# EAGLE design rc_remote_switch (EAGLE 6.4)
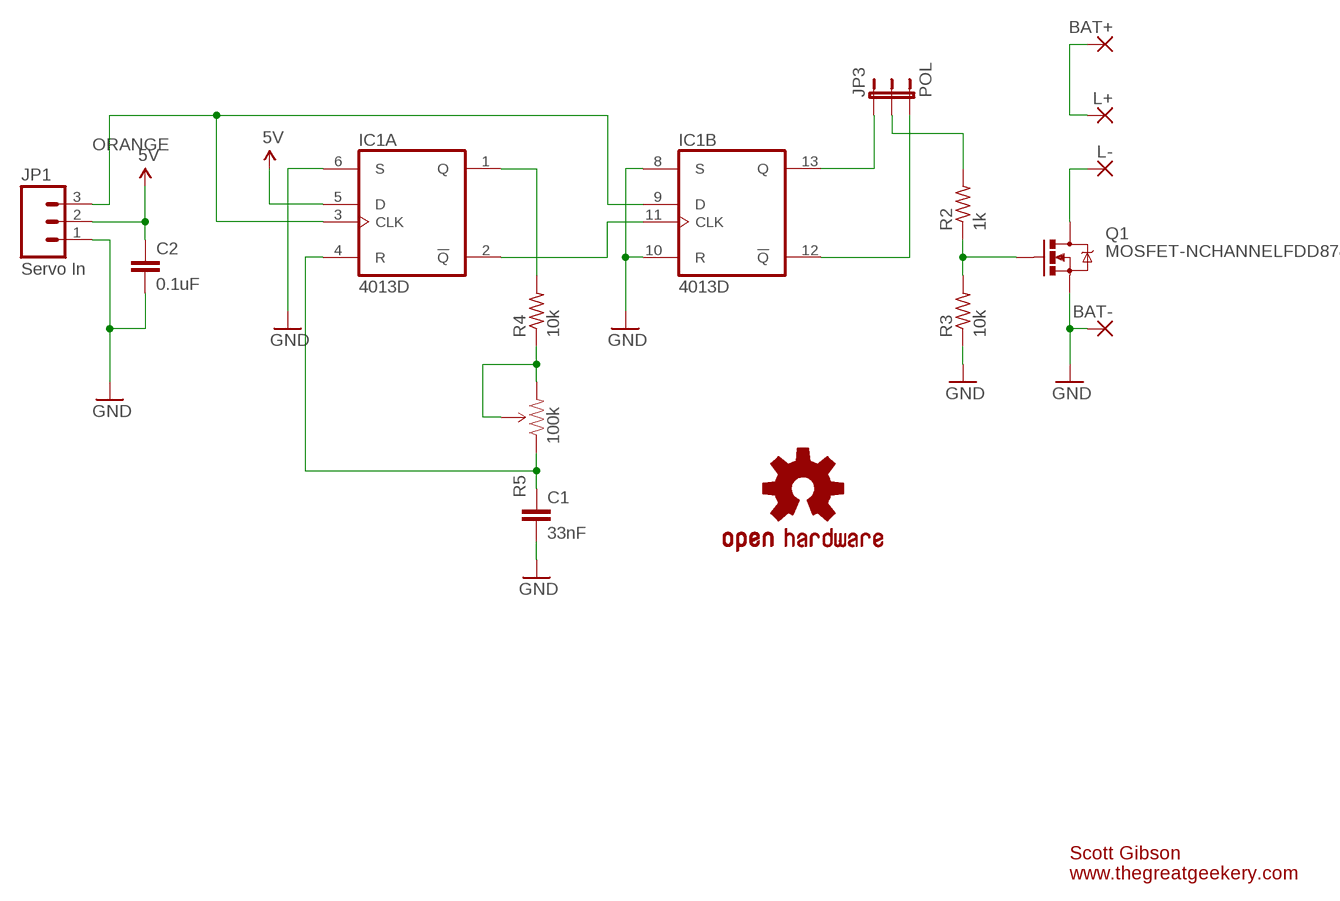
[diagram p0: schematic, sheet 1]

## Parts
BAT+  BAT+  WIREPAD4,16O1,6  [4,16O1,6]
BAT-  BAT-  WIREPAD4,16O1,6  [4,16O1,6]
C1  33nF  C-EUC0805  [C0805]
C2  0.1uF  C-EUC0805  [C0805]
IC1  4013D  [SO14]
JP1  Servo In  M03PTH  [1X03]
JP3  POL  JUMPER-3PTH  [1X03]
L+  L+  WIREPAD4,16O1,6  [4,16O1,6]
L-  L-  WIREPAD4,16O1,6  [4,16O1,6]
LOGO1  OSHW-LOGOS  [OSHW-LOGO-S]
Q1  MOSFET-NCHANNELFDD8780  [DPAK]
R2  1k  R-US_R0805  [R0805]
R3  10k  R-US_R0805  [R0805]
R4  10k  R-US_R0805  [R0805]
R5  100k  TRIMPOT3362U-2  [3362U-2]

## Nets
N$1: IC1.1(A:Q) R4.2
N$2: IC1.2(A:!Q) IC1.11(B:CLK)
N$3: IC1.13(B:Q) JP3.1
N$4: IC1.12(B:!Q) JP3.3
N$5: C1.1 IC1.4(A:R) R5.1(CCW)
N$6: R4.1 R5.2(WIPER) R5.3(CW)
N$7: Q1.1(G) R2.1 R3.2
N$8: JP3.2 R2.2
N$10: L-.1(P) Q1.4(D)
N$11: BAT+.1(P) L+.1(P)
ORANGE: IC1.3(A:CLK) IC1.9(B:D) JP1.3
VDD: BAT-.1(P) C1.2 C2.2 IC1.6(A:S) IC1.8(B:S) IC1.10(B:R) JP1.1 Q1.3(S) R3.1 ; supply symbol labelled GND
VSS: C2.1 IC1.5(A:D) JP1.2 ; supply symbol labelled 5V

## Notes on the sheet
- Scott Gibson
  www.thegreatgeekery.com

## Power pins joined to a net without a drawn wire
VDD: IC1.14(P:VDD)
VSS: IC1.7(P:VSS)

## Library data of the parts
BAT+ BAT- L+ L- = wirepad:WIREPAD: Wire PAD connect wire on PCB
C1 C2 = rcl:C-EU: CAPACITOR, European symbol
IC1 = 40xx:4013: Dual D FLIP FLOP, set/reset
JP1 = SparkFun-Connectors:M03: Header 3 Standard 3-pin 0.1" header. Use with straight break away headers (SKU : PRT-00116), right angle break away headers (PRT-00553), swiss pins (PRT-00743), machine pins (PRT-00117), and female headers (PRT-00115). Molex polarized connector foot print use with SKU : PRT-08232 with associated crimp pins and housings.
JP3 = SparkFun-Passives:JUMPER-3
LOGO1 = SparkFun-Aesthetics:OSHW-LOGO: Open Source Hardware Logo This logo indicates the piece of hardware it is found on incorporates a OSHW license and/or adheres to the definition of open source hardware found here: http://freedomdefined.org/OSHW
Q1 = SparkFun-DiscreteSemi:MOSFET-NCHANNEL: Common NMOSFET Parts MFG P/N Store ID Prod ID FDD8780 TRANS-09984 SI7820DN TRANS-11055 FDS6630A IC-08089 2N7002PW TRANS-11151 FQP30N06L COM-10213 TRANS-10060 BSS123LT1G TRANS-08345 BSS138 TRANS-00830 BS170 2N7000; PROD_ID: TRANS-09984
R2-R4 = rcl:R-US_: RESISTOR, American symbol
R5 = SparkFun-Electromechanical:TRIMPOT: Various small potentiometers for "set-and-forget" applications

## Board
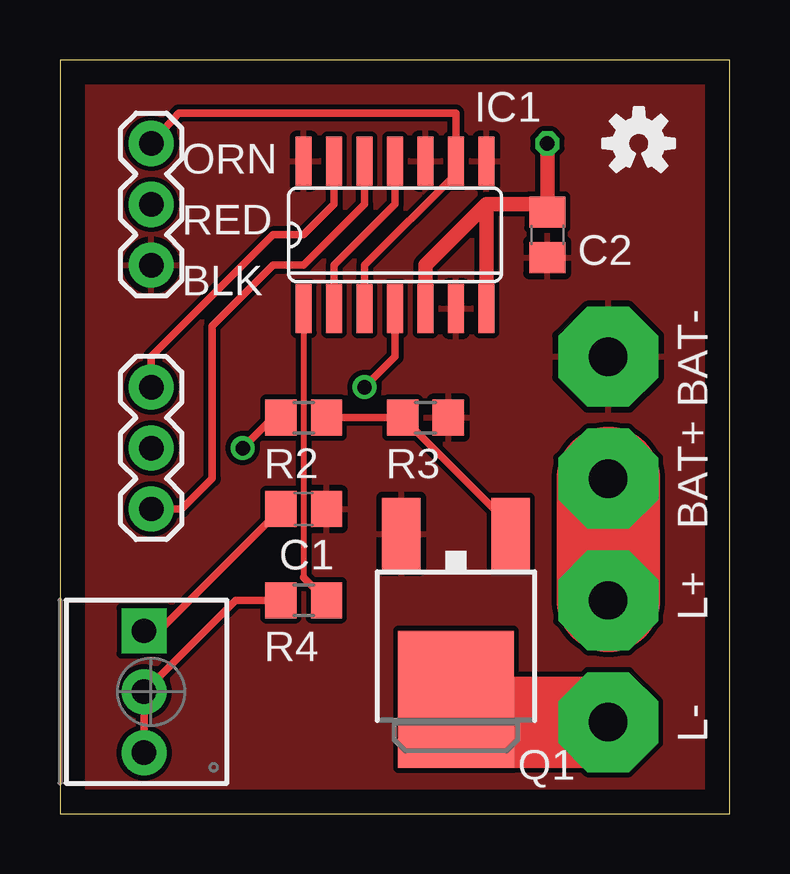
[diagram p1: board, top side]
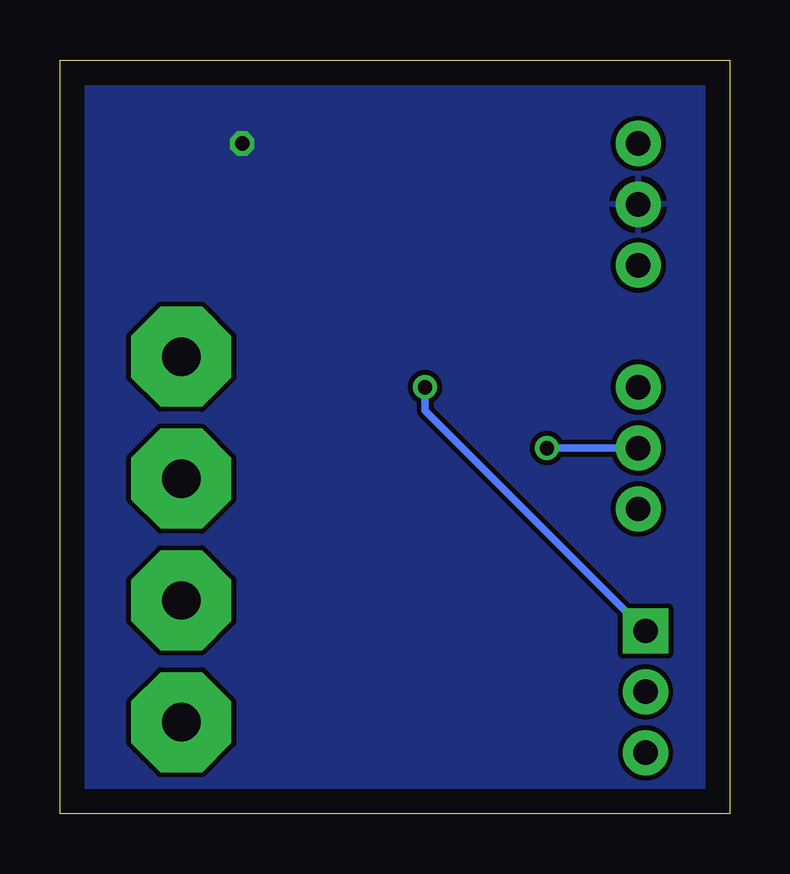
[diagram p2: board, bottom side, seen from below]

Size 27.92 x 31.42 mm. Coordinates in mm from the lower left corner, seen from the top.
Outline: 0,0 27.92,0 27.92,31.42 0,31.42 0,0
Copper layers (1*16): Top 0.035mm / dielectric 1.5mm / Bottom 0.035mm
Design rules "default": minimum track width 10mil, minimum drill 24mil, track to track 8mil, track to pad 8mil, pad to pad 8mil, via to via 8mil, smd to smd 8mil, copper to edge 40mil, drill to drill 8mil, minimum pad ring 10mil, minimum via ring 8mil, stop-mask expansion 4mil, vias tented up to drill 0mil, thermal gap 10mil

### Footprints (pad centres in the part's own frame; a part is rotated, then mirrored left to right if it is on the bottom)
4,16O1,6 = drill 1.6 pad 4.166 octagon: 1 0,0
C0805 = smd 1.3 x 1.5: 1 -0.95,0; 2 0.95,0
SO14 = smd 0.66 x 2.032: 1 -3.81,-3.073; 2 -2.54,-3.073; 3 -1.27,-3.073; 4 0,-3.073; 5 1.27,-3.073; 6 2.54,-3.073; 7 3.81,-3.073; 8 3.81,3.073; 9 2.54,3.073; 10 1.27,3.073; 11 0,3.073; 12 -1.27,3.073; 13 -2.54,3.073; 14 -3.81,3.073
1X03 = drill 1.016 pad 1.88: 1 0,0; 2 2.54,0; 3 5.08,0
DPAK = smd 1.6 x 3: 1 -2.28,-5.31; 3 2.28,-5.31 | smd 4.826 x 5.715: 4 0,1.588
R0805 = smd 1.3 x 1.5: 1 -0.95,0; 2 0.95,0
3362U-2 = drill 1.016 pad 1.88 square: 1 -2.54,-0.305 | drill 1.016 pad 1.88: 2 0,-0.305; 3 2.54,-0.305

### Placement (x,y rotation side)
BAT+  22.86,13.97 0 top
BAT-  22.86,19.05 0 top
C1  10.16,12.7 0 top
C2  20.32,24.13 270 top
IC1  13.97,24.13 0 top
JP1  3.81,22.86 90 top
JP3  3.81,17.78 270 top
L+  22.86,8.89 0 top
L-  22.86,3.81 0 top
LOGO1  24.13,27.94 0 top
Q1  16.51,6.35 180 top
R2  10.16,16.51 180 top
R3  15.24,16.51 180 top
R4  10.16,8.89 0 top
R5  3.81,5.08 270 top

### Tracks (layer width: path | path; a pad name or v marks a point on that pad's centre or on a via)
N$1
  Top 0.254: IC1.1 10.16,9.84
  Top 0.305: 10.16,9.84 R4.2
N$2
  Top 0.305: IC1.11 13.97,25.4 11.43,22.86 IC1.2
N$3
  Top 0.305: IC1.13 11.43,25.4 10.16,24.13 8.89,24.13 3.81,19.05 JP3.1
N$4
  Top 0.305: JP3.3 5.08,12.7 6.35,13.97 6.35,20.32 8.89,22.86 10.16,22.86 12.7,25.4 IC1.12
N$5  (via drill 0.6)
  Top 0.305: R5.1 4.13,7.62 C1.1 | IC1.4 13.97,19.05 v12.7,17.78
  Bottom 0.305: v12.7,17.78 12.7,16.82 R5.1
N$6
  Top 0.305: R4.1 7.32,8.89 R5.2 R5.3
N$7
  Top 0.305: Q1.1 18.79,12.01 R3.2 R2.1
N$8  (via drill 0.6)
  Top 0.305: R2.2 8.89,16.51 v7.62,15.24
  Bottom 0.305: v7.62,15.24 JP3.2
N$10
  Top 3.81: L-.1 17.46,3.81 Q1.4
N$11
  Top 4.318: L+.1 BAT+.1
ORANGE
  Top 0.305: JP1.3 4.95,29.21 16.51,29.21 IC1.9 16.51,26.67 12.7,22.86 IC1.3
VDD
  pour Top: -1.27,33.02 29.21,33.02 29.21,-1.27 -1.27,-1.27
VSS  (via drill 0.6)
  Top 0.61: IC1.5 15.24,22.86 17.78,25.4 | 17.78,25.4 20,25.4 C2.1 v20.32,27.94 | IC1.7 17.78,25.4
  pour Bottom: -1.27,33.02 29.21,33.02 29.21,-1.27 -1.27,-1.27

### Text on the board
tPlace: ORN | RED | BLK